# EAGLE design nixie tubes (EAGLE 9.5.1)
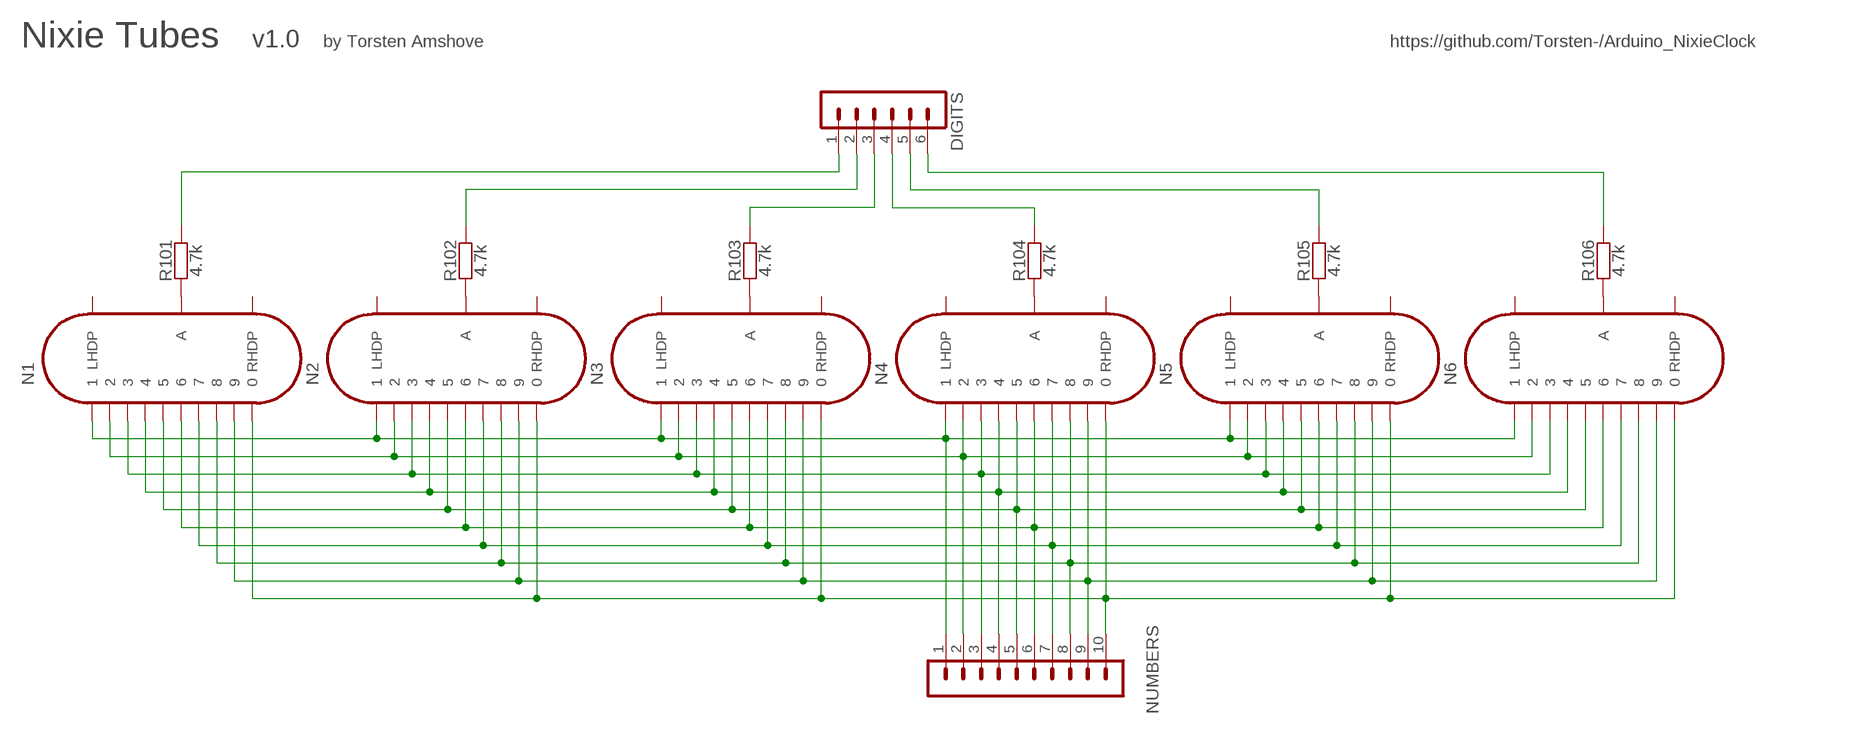
[diagram p0: schematic, sheet 1]

## Parts
DIGITS  MA06-1  [MA06-1]
N1  IN-14  [IN-14]
N2  IN-14  [IN-14]
N3  IN-14  [IN-14]
N4  IN-14  [IN-14]
N5  IN-14  [IN-14]
N6  IN-14  [IN-14]
NUMBERS  MA10-1  [MA10-1]
R101  4.7k  RESISTOR-10  [R0207/10]
R102  4.7k  RESISTOR-10  [R0207/10]
R103  4.7k  RESISTOR-10  [R0207/10]
R104  4.7k  RESISTOR-10  [R0207/10]
R105  4.7k  RESISTOR-10  [R0207/10]
R106  4.7k  RESISTOR-10  [R0207/10]

## Nets
N$1: N1.A R101.1
N$2: N2.A R102.1
N$3: N3.A R103.1
N$4: N4.A R104.1
N$5: N5.A R105.1
N$6: N6.A R106.1
N$7: N1.1 N2.1 N3.1 N4.1 N5.1 N6.1 NUMBERS.1
N$8: N1.2 N2.2 N3.2 N4.2 N5.2 N6.2 NUMBERS.2
N$9: N1.3 N2.3 N3.3 N4.3 N5.3 N6.3 NUMBERS.3
N$10: N1.4 N2.4 N3.4 N4.4 N5.4 N6.4 NUMBERS.4
N$11: N1.5 N2.5 N3.5 N4.5 N5.5 N6.5 NUMBERS.5
N$12: N1.6 N2.6 N3.6 N4.6 N5.6 N6.6 NUMBERS.6
N$13: N1.7 N2.7 N3.7 N4.7 N5.7 N6.7 NUMBERS.7
N$14: N1.8 N2.8 N3.8 N4.8 N5.8 N6.8 NUMBERS.8
N$15: N1.9 N2.9 N3.9 N4.9 N5.9 N6.9 NUMBERS.9
N$16: N1.0 N2.0 N3.0 N4.0 N5.0 N6.0 NUMBERS.10
N$17: DIGITS.1 R101.2
N$18: DIGITS.2 R102.2
N$19: DIGITS.3 R103.2
N$20: DIGITS.4 R104.2
N$21: DIGITS.5 R105.2
N$22: DIGITS.6 R106.2
Unconnected: N1.LHDP N1.RHDP N2.LHDP N2.RHDP N3.LHDP N3.RHDP N4.LHDP N4.RHDP N5.LHDP N5.RHDP N6.LHDP N6.RHDP

## Notes on the sheet
- Nixie Tubes | v1.0 | by Torsten Amshove | https://github.com/Torsten-/Arduino_NixieClock

## Library data of the parts
DIGITS = con-lstb:MA06-1: PIN HEADER; OC_FARNELL: unknown; OC_NEWARK: unknown
N1-N6 = russian-nixies:IN-14: IN-14: medium numeric frontview nixie tube
NUMBERS = con-lstb:MA10-1: PIN HEADER; OC_FARNELL: unknown; OC_NEWARK: unknown
R101-R106 = we-rcl:RESISTOR: Resistor all kinds in 0402 and 0603

## Board
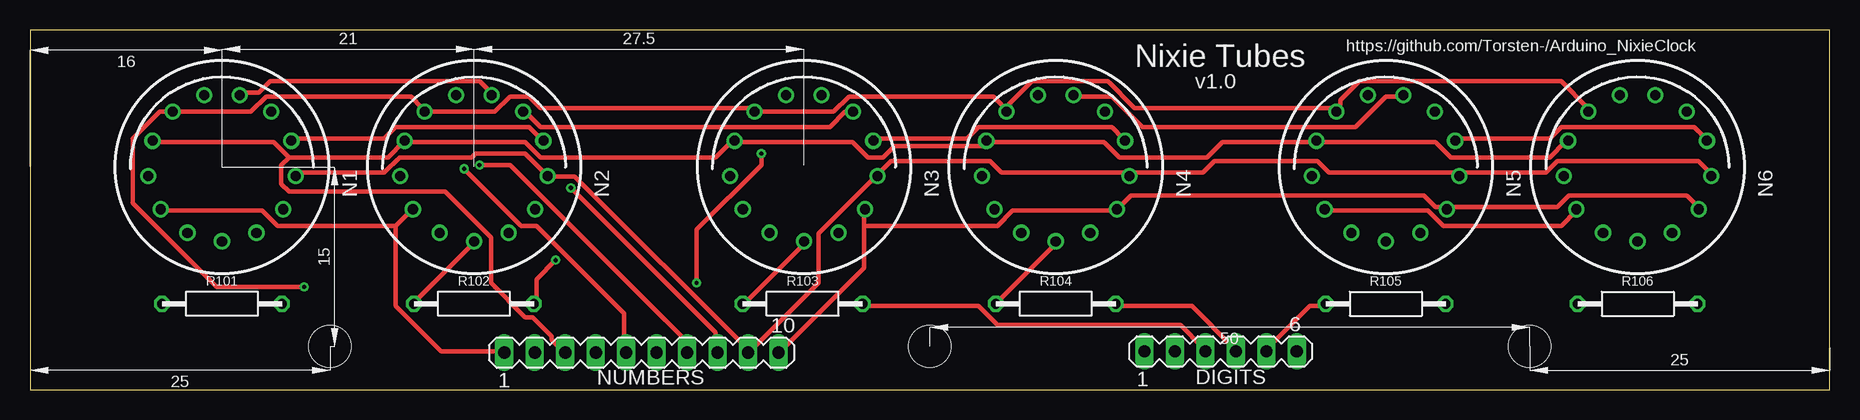
[diagram p1: board, top side]
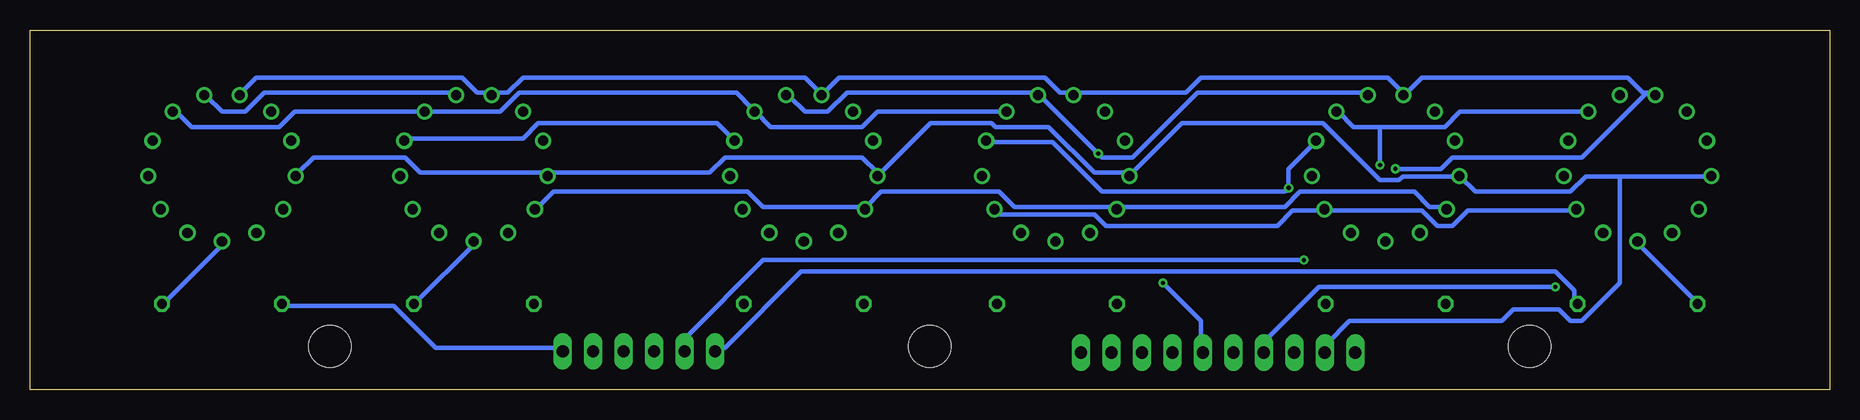
[diagram p2: board, bottom side, seen from below]

Size 150 x 30 mm. Coordinates in mm from the lower left corner, seen from the top.
Outline: 0,0 150,0 150,30 0,30 0,0
Copper layers (1*16): Top 0.035mm / dielectric 1.5mm / Bottom 0.035mm
Design rules "default *": minimum track width 15mil, minimum drill 0.35mm, track to track 10mil, track to pad 10mil, pad to pad 6mil, via to via 6mil, smd to smd 6mil, copper to edge 40mil, drill to drill 6mil, minimum pad ring 10mil, minimum via ring 8mil, stop-mask expansion 4mil, vias tented up to drill 0mil, thermal gap 10mil
Holes 3.5 mm at 25,3.6 75,3.6 125,3.6

### Footprints (pad centres in the part's own frame; a part is rotated, then mirrored left to right if it is on the bottom)
MA06-1 = drill 1.016 long: 1 -6.35,0; 2 -3.81,0; 3 -1.27,0; 4 1.27,0; 5 3.81,0; 6 6.35,0
IN-14 = drill 0.84: 0 5.094,-3.516; 1 -5.094,-3.516; 2 -6.145,-0.746; 3 -5.788,2.195; 4 -4.105,4.633; 5 -1.481,6.01; 6 1.481,6.01; 7 4.105,4.633; 8 5.788,2.195; 9 6.145,-0.746; A 0,-6.19; LHDP 2.877,-5.481; RHDP -2.877,-5.481
MA10-1 = drill 1.016 long: 1 -11.43,0; 2 -8.89,0; 3 -6.35,0; 4 -3.81,0; 5 -1.27,0; 6 1.27,0; 7 3.81,0; 8 6.35,0; 9 8.89,0; 10 11.43,0
R0207/10 = drill 0.813 octagon: 1 -5,0; 2 5,0

### Placement (x,y rotation side)
DIGITS  99.24,3.18 0 top
N1  16,18.56 0 top
N2  37.01,18.56 0 top
N3  64.51,18.56 0 top
N4  85.5,18.56 0 top
N5  113.01,18.56 0 top
N6  134,18.56 0 top
NUMBERS  50.97,3.08 0 top
R101  16,7.15 0 top
R102  37,7.15 0 top
R103  64.4,7.15 0 top
R104  85.5,7.15 0 top
R105  113,7.15 180 top
R106  134,7.15 180 top

### Tracks (layer width: path | path; a pad name or v marks a point on that pad's centre or on a via)
N$1
  Bottom 0.381: R101.1 11.11,7.3 15.88,12.06 N1.A
N$2
  Top 0.381: R102.1 32.07,7.3 36.83,12.06 N2.A
N$3
  Top 0.381: R103.1 59.69,7.3 64.45,12.06 N3.A
N$4
  Top 0.381: R104.1 80.64,7.3 85.41,12.06 N4.A
N$5
  Bottom 0.381: R105.1 117.79,7.3 113.03,12.06 N5.A
N$6
  Bottom 0.381: R106.1 138.75,7.3 133.99,12.06 N6.A
N$7
  Top 0.381: 30.48,13.65 20.64,13.65 19.37,14.92 11.11,14.92 N1.1 | 30.48,13.65 31.75,14.92 N2.1 | 30.48,13.65 30.48,6.99 34.29,3.17 39.37,3.17 NUMBERS.1 | N5.1 107.95,14.92 116.52,14.92 117.79,13.65 127.64,13.65 128.91,14.92 N6.1
  Bottom 0.381: N5.1 107.63,15.24 106.36,16.51 90.17,16.51 88.9,15.24 80.64,15.24 N4.1 80.33,15.24 79.06,16.51 69.22,16.51 67.94,15.24 59.69,15.24 N3.1 59.37,15.24 45.4,15.24 44.13,16.51 34.61,16.51 33.34,15.24 32.07,15.24 N2.1
N$8
  Bottom 0.381: 17.46,17.78 20.32,17.78 21.59,16.51 29.53,16.51 30.8,17.78 N2.2 31.11,17.78 35.56,17.78 35.88,17.46 37.47,17.46 42.23,22.23 53.98,22.23 58.1,18.1 N3.2 58.42,18.1 61.28,18.1 65.09,21.91 69.53,21.91 69.85,22.23 74.93,22.23 79.06,18.1 N4.2 79.38,18.1 80.64,19.37 92.08,19.37 93.34,18.1 106.68,18.1 N5.2 107,18.1 117.47,18.1 118.75,19.37 126.36,19.37 127.64,18.1 N6.2 | 17.46,17.78 10.16,17.78 N1.2 | 17.46,17.78 17.46,8.89 20.64,5.71 21.59,5.71 22.54,6.67 26.35,6.67 27.3,5.71 40.01,5.71 41.91,3.81 41.91,3.17 NUMBERS.2
N$9
  Top 0.381: 21.59,19.37 20.32,20.64 10.48,20.64 N1.3 | 21.59,19.37 29.84,19.37 31.11,20.64 N2.3 31.43,20.64 41.27,20.64 42.55,19.37 57.15,19.37 58.42,20.64 N3.3 58.74,20.64 68.58,20.64 69.85,19.37 71.12,19.37 72.07,20.32 79.38,20.32 79.69,20.64 N4.3 80.01,20.64 89.53,20.64 90.81,19.37 98.11,19.37 99.38,20.64 107,20.64 N5.3 107.31,20.64 117.16,20.64 118.43,19.37 126.68,19.37 127.95,20.64 N6.3 | 21.59,19.37 20.95,18.73 20.95,17.14 21.59,16.51 34.61,16.51 38.42,12.7 38.42,8.89 41.27,6.03 41.91,6.03 43.5,4.45 43.5,4.13 44.45,3.17 NUMBERS.3
N$10  (via drill 0.35)
  Top 0.381: N6.4 129.86,23.5 127.64,25.72 110.81,25.72 109.22,24.13 109.22,23.5 N5.4 108.9,23.5 92.08,23.5 89.85,25.72 83.5,25.72 81.28,23.5 | 81.28,23.5 80.33,24.45 68.26,24.45 66.99,23.18 60.64,23.18 N3.4 60.33,23.5 42.55,23.5 41.59,24.45 40.01,24.45 38.73,23.18 33.02,23.18 N2.4 32.7,23.5 31.75,24.45 19.68,24.45 18.41,23.18 12.06,23.18 N1.4 11.75,23.18 10.79,23.18 8.57,20.95 8.57,15.56 15.56,8.57 v22.86,8.57 | 81.28,23.5 N4.4
  Bottom 0.381: v22.86,8.57 42.55,8.57 46.99,4.13 46.99,3.17 NUMBERS.4
N$11  (via drill 0.35)
  Top 0.381: v36.2,18.41 40.96,13.65 42.23,13.65 49.53,6.35 49.53,3.17 NUMBERS.5
  Bottom 0.381: N6.5 132.4,24.77 131.13,26.04 113.98,26.04 112.71,24.77 111.76,24.77 N5.5 111.44,24.77 110.17,24.77 108.9,26.04 85.41,26.04 84.14,24.77 N4.5 83.82,24.77 82.55,26.04 65.41,26.04 64.14,24.77 63.18,24.77 N3.5 62.87,24.77 53.66,24.77 52.39,26.04 36.83,26.04 35.56,24.77 N2.5 35.24,24.77 33.97,26.04 16.83,26.04 15.56,24.77 15.24,24.77 | 15.24,24.77 14.61,24.77 N1.5 15.24,24.77 | v36.2,18.41 32.38,18.41 31.43,19.37 20.64,19.37 15.24,24.77
N$12  (via drill 0.35)
  Top 0.381: N1.6 17.78,24.77 19.05,24.77 20,25.72 37.47,25.72 38.42,24.77 N2.6 | v55.56,8.89 55.56,13.34 60.96,18.73 v60.96,19.68 | N5.6 114.3,24.45 113.03,24.45 110.49,21.91 92.71,21.91 90.17,24.45 87,24.45 N4.6
  Bottom 0.381: N5.6 114.62,24.77 130.49,24.77 132.08,23.18 133.99,23.18 135.25,24.45 N6.6 | N4.6 86.68,24.45 85.41,23.18 83.5,23.18 81.92,24.77 66.04,24.77 N3.6 65.72,24.45 v60.96,19.68 60.64,19.37 58.1,19.37 52.7,24.77 38.73,24.77 N2.6 | v55.56,8.89 52.39,5.71 52.39,3.17 NUMBERS.6
N$13  (via drill 0.35)
  Top 0.381: v37.47,18.73 40.01,18.73 54.61,4.13 54.61,3.17 NUMBERS.7 | N3.7 68.58,23.18 67.94,23.18 66.67,21.91 42.55,21.91 41.27,23.18 N2.7
  Bottom 0.381: N6.7 137.79,23.18 136.53,21.91 129.22,21.91 127.95,23.18 117.16,23.18 N5.7 116.84,23.18 110.81,23.18 109.22,24.77 91.12,24.77 89.85,23.5 N4.7 89.53,23.18 88.27,21.91 80.64,21.91 79.38,23.18 68.9,23.18 N3.7 | 37.47,21.91 39.69,21.91 40.96,23.18 N2.7 | 37.47,21.91 32.07,21.91 30.8,23.18 20.32,23.18 N1.7 | 37.47,21.91 v37.47,18.73
N$14  (via drill 0.35)
  Top 0.381: N5.8 119.06,20.95 126.68,20.95 127.64,21.91 138.75,21.91 139.7,20.95 N6.8 | N3.8 70.48,20.95 78.11,20.95 79.06,21.91 90.17,21.91 91.12,20.95 N4.8 | N1.8 21.91,20.95 29.53,20.95 30.48,21.91 41.59,21.91 42.55,20.95 N2.8 | v45.09,16.83 57.15,4.76 57.15,3.17 NUMBERS.8
  Bottom 0.381: N2.8 42.86,20.64 45.09,18.41 v45.09,16.83 45.4,16.51 60.64,16.51 64.77,20.64 70.17,20.64 N3.8 | N5.8 118.75,20.95 108.9,20.95 107.63,22.23 92.71,22.23 91.44,20.95 N4.8
N$15
  Top 0.381: N1.9 22.23,18.1 29.53,18.1 30.8,19.37 36.83,19.37 37.15,19.68 41.27,19.68 42.86,18.1 N2.9 43.18,17.78 45.4,17.78 60.01,3.17 | N6.9 140.02,18.1 139.06,19.05 127.32,19.05 126.36,18.1 119.38,18.1 N5.9 119.06,18.1 108.27,18.1 107.31,19.05 98.74,19.05 97.79,18.1 91.76,18.1 N4.9 91.44,18.1 80.96,18.1 80.01,19.05 71.75,19.05 70.8,18.1 N3.9 70.48,17.78 65.72,13.02 65.72,8.89 60.01,3.17 | 60.01,3.17 NUMBERS.9
N$16
  Top 0.381: N6.0 139.06,15.24 138.11,16.19 128.27,16.19 127.32,15.24 118.11,15.24 N5.0 117.79,15.24 117.16,15.24 116.2,16.19 91.76,16.19 90.81,15.24 N4.0 90.49,14.92 81.92,14.92 80.64,13.65 69.53,13.65 | 69.53,13.65 69.53,10.16 62.55,3.17 NUMBERS.10 | 69.53,13.65 69.53,14.92 N3.0
  Bottom 0.381: N1.0 21.27,14.92 30.16,14.92 31.43,13.65 32.7,13.65 33.97,14.92 41.91,14.92 N2.0 42.23,14.92 44.77,14.92 46.04,13.65 60.33,13.65 61.28,14.61 69.22,14.61 69.53,14.92 N3.0
N$17
  Bottom 0.381: R101.2 21.27,7.3 21.27,8.26 22.86,9.84 85.72,9.84 92.08,3.49 92.71,3.49 DIGITS.1
N$18  (via drill 0.35)
  Top 0.381: v43.81,10.79 42.23,9.21 42.23,7.3 R102.2
  Bottom 0.381: v43.81,10.79 88.9,10.79 95.25,4.45 95.25,3.49 DIGITS.2
N$19
  Top 0.381: R103.2 69.53,6.99 79.06,6.99 80.64,5.4 95.89,5.4 97.79,3.49 DIGITS.3
N$20
  Top 0.381: R104.2 90.81,6.99 96.84,6.99 100.33,3.49 DIGITS.4
N$21
  Top 0.381: R105.2 107.95,6.99 106.68,6.99 103.19,3.49 DIGITS.5
N$22
  Bottom 0.381: R106.2 128.91,6.99 119.7,6.99 116.2,3.49 105.73,3.49 DIGITS.6

### Text on the board
tPlace: https://github.com/Torsten-/Arduino_NixieClock | Nixie Tubes | v1.0